# Altium project Power Electronics Final Projects.PrjPcb
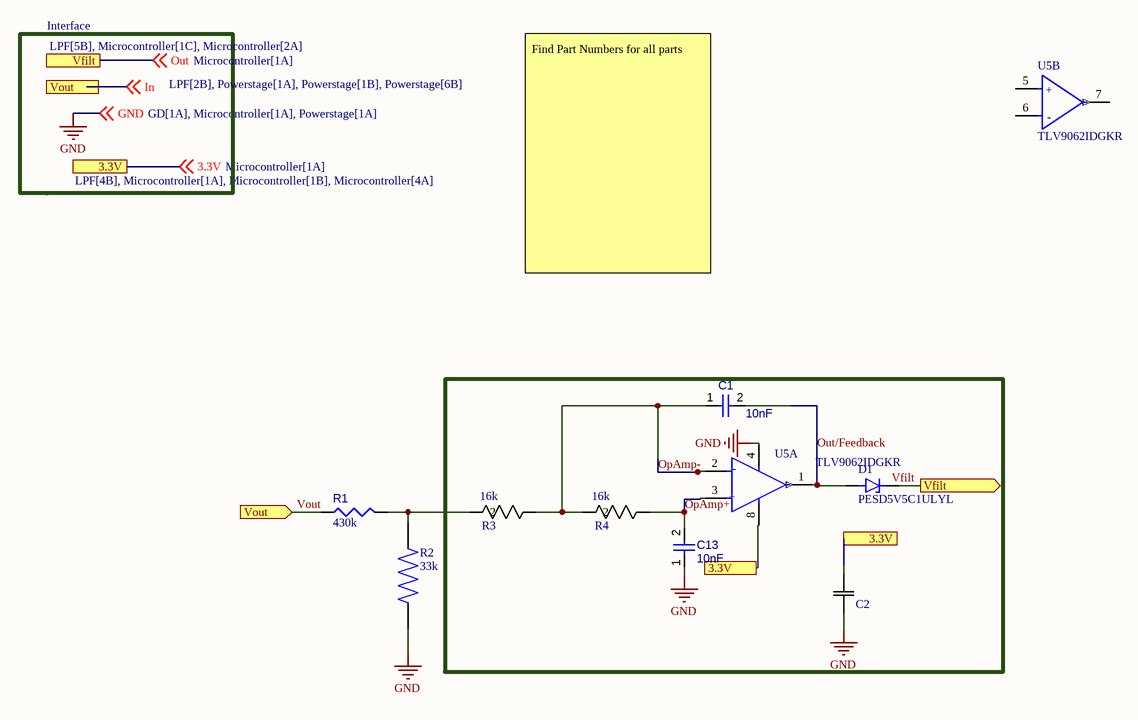
[diagram p0: LPF.SchDoc]
4 sheets, 46 parts. Net scope: flat (ports and power ports of the same name join across sheets).
Board file: Buck Converter.PcbDoc
Sheets:
  LPF.SchDoc
  Microcontroller.SchDoc
  Powerstage.SchDoc
  GD.SchDoc

## Sheet LPF.SchDoc
size A3; SheetNumber: 1; SheetTotal: 4

### Parts
(Parts that share a designator on the sheet are numbered #1, #2 ... from top to bottom, then left to right.)
C1  10nF  [WCAP-CSMH_0805_L2W1.25H1.25]
C2  TMCP1D105MTRF  [CAP_TMCHPTMCP_VIS]  (value not drawn)
C13  10nF  [WCAP-CSMH_0805_L2W1.25H1.25]
D1#1  PESD5V5C1ULYL  [DIO_PESD5V5C1ULYL]
R1  value 430k  [RESC2013X60X40LL20T25]  (hidden comment: ERA-6AEB434V)
R2  value 33k  [RESC2012X65N]  (hidden comment: RNCF0805DTE33K0)
R3  16k  [RC0805N_YAG]
R4  16k  [RC0805N_YAG]
U5  TLV9062IDGKR  [FP-DGK0008A-IPC_A]  (parts A,B of 2)

### Ports
3.3V (see LPF[1A], LPF[4B], Microcontroller[1A], Microcontroller[1B], Microcontroller[4A]), 3.3V (see LPF[4B], Microcontroller[1A], Microcontroller[1B], Microcontroller[4A]), Vfilt (out, see LPF[1A], Microcontroller[1C], Microcontroller[2A]), Vfilt (see LPF[5B], Microcontroller[1C], Microcontroller[2A]), Vout (in, see LPF[1A], Powerstage[1A], Powerstage[1B], Powerstage[6B]), Vout (in, see LPF[2B], Powerstage[1A], Powerstage[1B], Powerstage[6B])

### Nets
GND: C2.1 C13.1 R2.1 U5.4(V-) ; off-sheet GND
3.3V: C2.2 U5.8(V+) ; off-sheet 3.3V, port 3.3V
OpAmp+: C13.2 R4.1 U5.3(IN1+)
OpAmp-: C1.1 R3.1 R4.2 U5.2(IN1-)
Out: D1#1.K ; off-sheet Out, port Vfilt  [project net Vfilt]
Out/Feedback: C1.2 D1#1.A U5.1(OUT1)
Vout: R1.1 ; off-sheet In, port Vout  [also labelled In]
NetR1_2: R1.2 R2.2 R3.2

Not connected (* = marked no-connect by the designer): U5 5(IN2+) 6(IN2-) 7(OUT2)

### Notes on the sheet
- Interface
- Find Part Numbers for all parts
- Labels drawn without touching a wire or pin: Vfilt
- (in symbol CMP-014-00008-1, part A) -; +
- (in symbol CMP-014-00008-1, part B) +; -

### Library data of the parts
C1 C13 = CMP-001-00106-1: Ceramic Capacitor, Multilayer, Ceramic, 500V, 10% +Tol, 10% -Tol, X7R, 15% TC, 0.01uF, Surface Mount, 0805. 885342207014
C2 = CMP-001-00110-1: No Description Available; Mfr_Name: Vishay; Design Item ID: TMCP1D105MTRF; Source: TMCP1D105MTRF.SchLib
D1#1 = CMP-004-00045-1: Esd Protection Device, 5.5V, Dfn1006 Rohs Compliant: Yes; MF: Nexperia USA Inc.; MP: PESD5V5C1ULYL; SnapEDA_Link: https://www.snapeda.com/parts/PESD5V5C1ULYL/Nexperia/view-part/?ref=snap; Check_prices: https://www.snapeda.com/parts/PESD5V5C1ULYL/Nexperia/view-part/?ref=eda; Value: *; Component Type: Standard; Design Item ID: PESD5V5C1ULYL; Pins: 2; Case/Package: SOD-882 Nexperia USA; Source: PESD5V5C1ULYL.SchLib
R1 = CMP-009-00255-1: Fixed Resistor, Thin Film, 0.125W, 430000ohm, 100V, 0.1% +/-Tol, 25ppm/Cel, Surface Mount, 0805; Power: 125mW; Max Operating Temperature: 155°C; Case/Package: 0805; Tolerance: 0.1%; JESD-609 Code: e3; RoHS Compliant: Yes; Min Operating Temperature: -55°C; Mounting Technology: Surface Mount; Construction: Rectangular; Pins: 2
R2 = CMP-009-00254-1: Pins: 2; Price: None; MP: RNCF0805DTE33K0; Availability: Unavailable; Case/Package: None; Component Type: Standard; Design Item ID: RNCF0805DTE33K0; Source: RNCF0805DTE33K0.SchLib
R3 R4 = CMP-009-00253-1: RC0805FR-0716KL; Mfr_Name: Yageo; Source: RC0805FR-0716KL.SchLib; Design Item ID: RC0805FR-0716KL
U5 = CMP-014-00008-1: Operational Amplifier, 2 Func, 1600uV Offset-Max, CMOS, PDSO8; Supply Voltage Limit-Max: 6V; Common-mode Reject Ratio-Nom: 103dB; Unity Gain BW-Nom: 10MHz; Nominal Supply Voltage: 5V; Channels: 2; Slew Rate: 6.5V/µs; Input Offset Voltage-Max: 2mV; Package Body Material: Plastic; Package Style: SMALL OUTLINE, THIN PROFILE, SHRINK PITCHMeter; Terminal Pitch: 0.65mm; RoHS Compliant: Yes; Width: 3mm; Pins: 8; Length: 3mm; Case/Package: TSSOP; Temperature Grade: AUTOMOTIVE; Terminal Position: DUAL; Surface Mount: Yes; Terminal Form: Gull Wing; Max Operating Temperature: 125°C; Moisture Sensitivity Level: 2; JESD-30 Code: S-PDSO-G8; Min Operating Temperature: -40°C; Height - Seated (Max): 1.1mm; Amplifier Type: OPERATIONAL AMPLIFIER; Technology: CMOS; Package Shape: Square; Reach SVHC Compliant: Yes

## Sheet Microcontroller.SchDoc
size A3; SheetNumber: 2; SheetTotal: 4
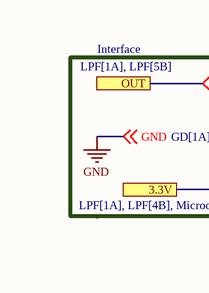
[diagram p1: Microcontroller.SchDoc, left]
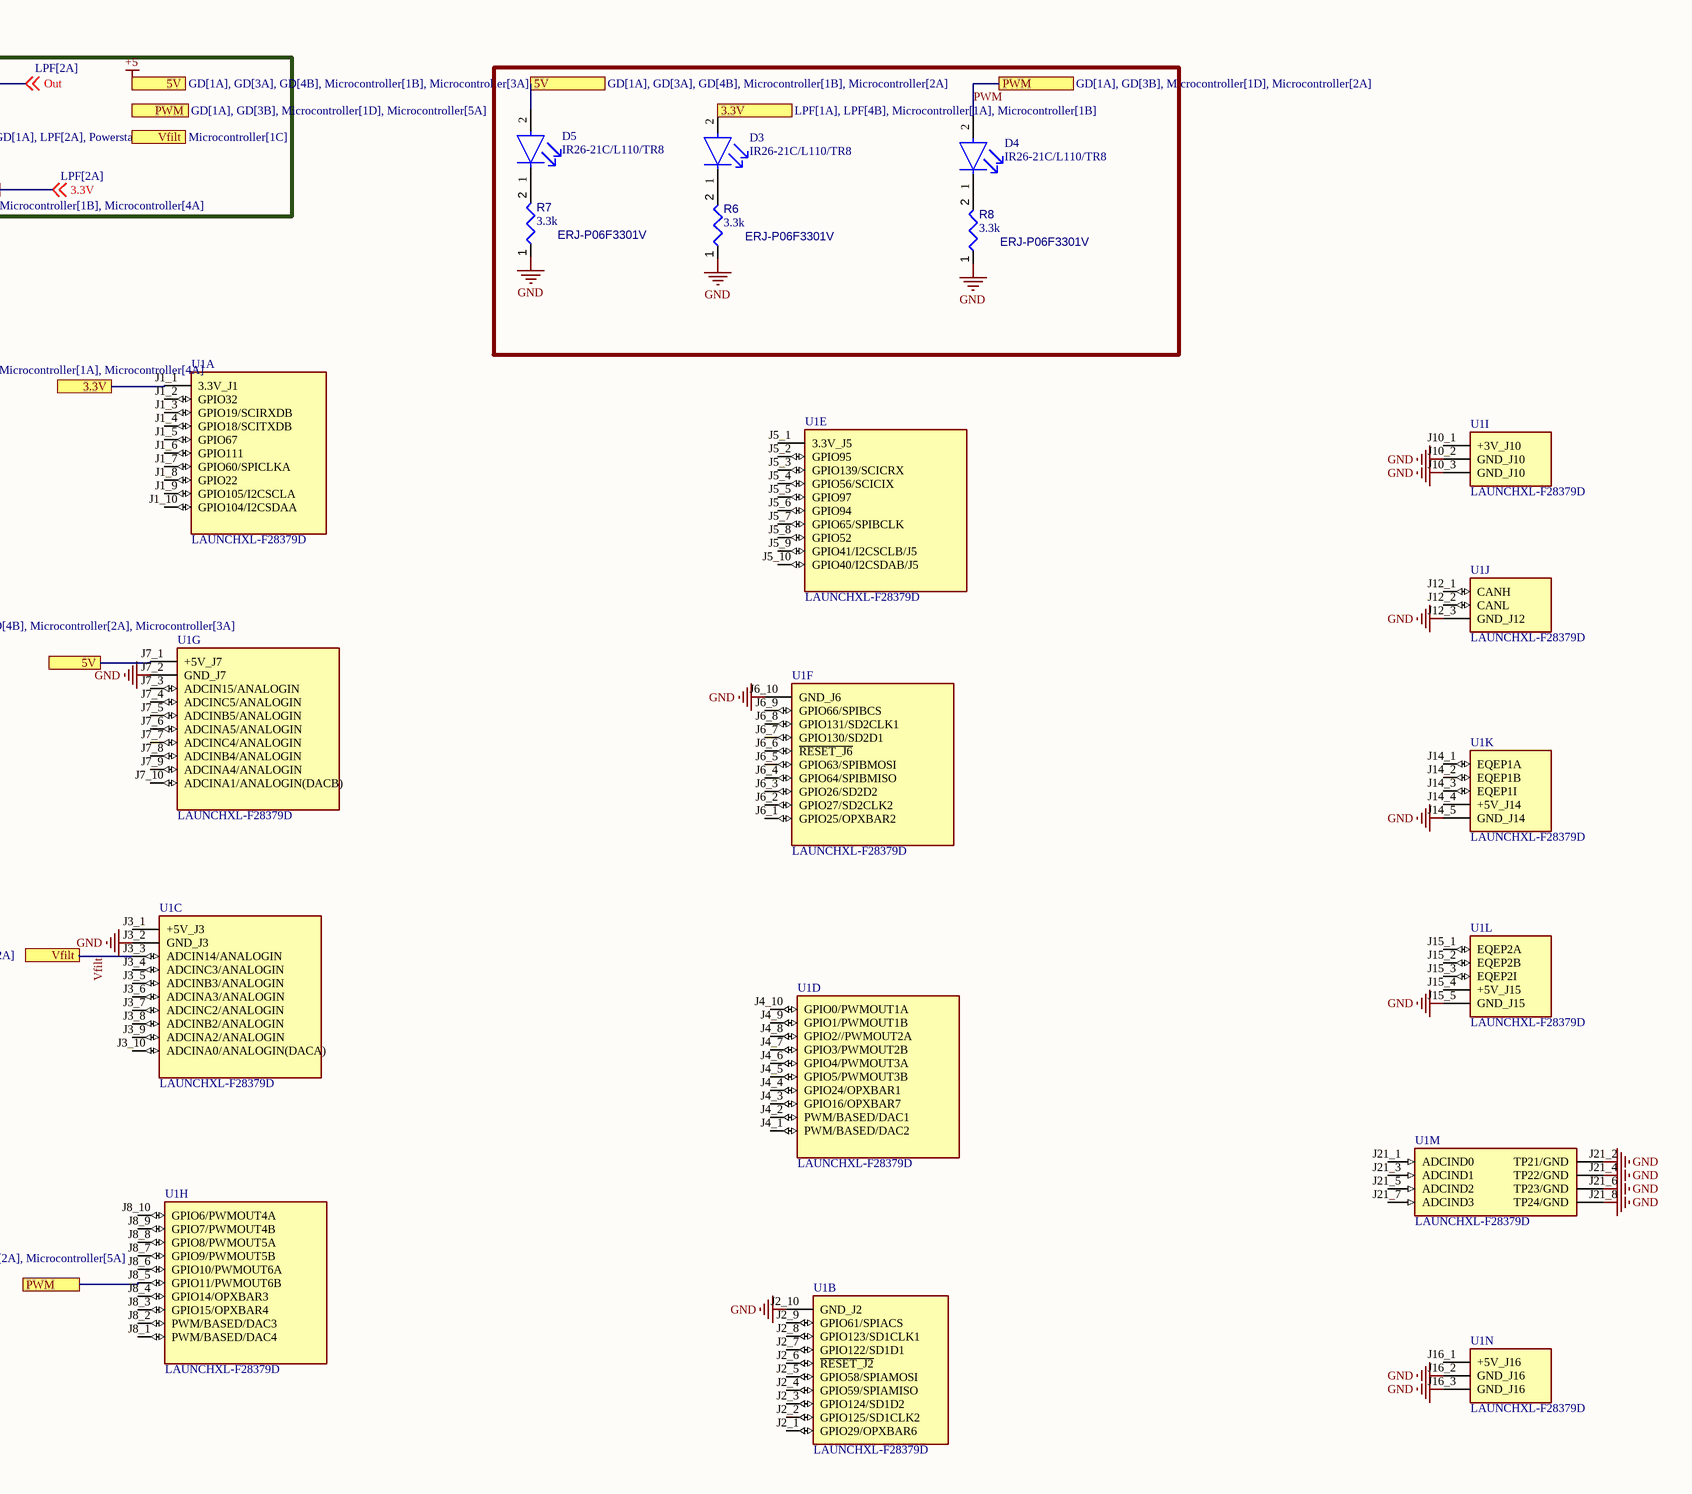
[diagram p2: Microcontroller.SchDoc, right]

### Parts
D3  IR26-21C/L110/TR8  [FP-APTD3216CGCK-MFG]
D4  IR26-21C/L110/TR8  [FP-APTD3216CGCK-MFG]
D5  IR26-21C/L110/TR8  [FP-APTD3216CGCK-MFG]
R6  ERJ-P06F3301V  value 3.3k  [RESC0805(2012)_L]
R7  ERJ-P06F3301V  value 3.3k  [RESC0805(2012)_L]
R8  ERJ-P06F3301V  value 3.3k  [RESC0805(2012)_L]
U1  LAUNCHXL-F28379D  [MOD_LAUNCHXL-F28379D]  (parts A,B,C,D,E,F,G,H,I,J,K,L,M,N of 14)

### Ports
3.3V (see LPF[1A], LPF[4B], Microcontroller[1A], Microcontroller[1B]), 3.3V (see LPF[1A], LPF[4B], Microcontroller[1A], Microcontroller[4A]), 3.3V (see LPF[1A], LPF[4B], Microcontroller[1B], Microcontroller[4A]), 5V (see GD[1A], GD[3A], GD[4B], Microcontroller[1B], Microcontroller[2A]), 5V (see GD[1A], GD[3A], GD[4B], Microcontroller[1B], Microcontroller[3A]), 5V (see GD[1A], GD[3A], GD[4B], Microcontroller[2A], Microcontroller[3A]), OUT (see LPF[1A], LPF[5B]), PWM (see GD[1A], GD[3B], Microcontroller[1D], Microcontroller[2A]), PWM (see GD[1A], GD[3B], Microcontroller[1D], Microcontroller[5A]), PWM (see GD[1A], GD[3B], Microcontroller[2A], Microcontroller[5A]), Vfilt (see Microcontroller[1C]), Vfilt (see Microcontroller[2A])

### Nets
+5: D5.2(A) U1.J7_1(+5V_J7) ; port 5V
GND: R6.1 R7.1 R8.1 U1.J2_10(GND_J2) U1.J3_2(GND_J3) U1.J6_10(GND_J6) U1.J7_2(GND_J7) U1.J10_2(GND_J10) U1.J10_3(GND_J10) U1.J12_3(GND_J12) U1.J14_5(GND_J14) U1.J15_5(GND_J15) U1.J16_2(GND_J16) U1.J16_3(GND_J16) U1.J21_2(TP21/GND) U1.J21_4(TP22/GND) U1.J21_6(TP23/GND) U1.J21_8(TP24/GND) ; off-sheet GND
3.3V: D3.2(A) U1.J1_1(3.3V_J1) ; off-sheet 3.3V, port 3.3V
PWM: D4.2(A) U1.J8_5(GPIO11/PWMOUT6B) ; port PWM
Vfilt: U1.J3_3(ADCIN14/ANALOGIN) ; off-sheet Out, port OUT, port Vfilt  [also labelled Out]
NetD3_1: D3.1(C) R6.2
NetD4_1: D4.1(C) R8.2
NetD5_1: D5.1(C) R7.2

Not connected (* = marked no-connect by the designer): U1 J1_2(GPIO32) J1_3(GPIO19/SCIRXDB) J1_4(GPIO18/SCITXDB) J1_5(GPIO67) J1_6(GPIO111) J1_7(GPIO60/SPICLKA) J1_8(GPIO22) J1_9(GPIO105/I2CSCLA) J1_10(GPIO104/I2CSDAA) J2_1(GPIO29/OPXBAR6) J2_2(GPIO125/SD1CLK2) J2_3(GPIO124/SD1D2) J2_4(GPIO59/SPIAMISO) J2_5(GPIO58/SPIAMOSI) J2_6(~{RESET_J2}) J2_7(GPIO122/SD1D1) J2_8(GPIO123/SD1CLK1) J2_9(GPIO61/SPIACS) J3_1(+5V_J3) J3_4(ADCINC3/ANALOGIN) J3_5(ADCINB3/ANALOGIN) J3_6(ADCINA3/ANALOGIN) J3_7(ADCINC2/ANALOGIN) J3_8(ADCINB2/ANALOGIN) J3_9(ADCINA2/ANALOGIN) J3_10(ADCINA0/ANALOGIN(DACA)) J4_1(PWM/BASED/DAC2) J4_2(PWM/BASED/DAC1) J4_3(GPIO16/OPXBAR7) J4_4(GPIO24/OPXBAR1) J4_5(GPIO5/PWMOUT3B) J4_6(GPIO4/PWMOUT3A) J4_7(GPIO3/PWMOUT2B) J4_8(GPIO2//PWMOUT2A) J4_9(GPIO1/PWMOUT1B) J4_10(GPIO0/PWMOUT1A) J5_1(3.3V_J5) J5_2(GPIO95) J5_3(GPIO139/SCICRX) J5_4(GPIO56/SCICIX) J5_5(GPIO97) J5_6(GPIO94) J5_7(GPIO65/SPIBCLK) J5_8(GPIO52) J5_9(GPIO41/I2CSCLB/J5) J5_10(GPIO40/I2CSDAB/J5) J6_1(GPIO25/OPXBAR2) J6_2(GPIO27/SD2CLK2) J6_3(GPIO26/SD2D2) J6_4(GPIO64/SPIBMISO) J6_5(GPIO63/SPIBMOSI) J6_6(~{RESET_J6}) J6_7(GPIO130/SD2D1) J6_8(GPIO131/SD2CLK1) J6_9(GPIO66/SPIBCS) J7_3(ADCIN15/ANALOGIN) J7_4(ADCINC5/ANALOGIN) J7_5(ADCINB5/ANALOGIN) J7_6(ADCINA5/ANALOGIN) J7_7(ADCINC4/ANALOGIN) J7_8(ADCINB4/ANALOGIN) J7_9(ADCINA4/ANALOGIN) J7_10(ADCINA1/ANALOGIN(DACB)) J8_1(PWM/BASED/DAC4) J8_2(PWM/BASED/DAC3) J8_3(GPIO15/OPXBAR4) J8_4(GPIO14/OPXBAR3) J8_6(GPIO10/PWMOUT6A) J8_7(GPIO9/PWMOUT5B) J8_8(GPIO8/PWMOUT5A) J8_9(GPIO7/PWMOUT4B) J8_10(GPIO6/PWMOUT4A) J10_1(+3V_J10) J12_1(CANH) J12_2(CANL) J14_1(EQEP1A) J14_2(EQEP1B) J14_3(EQEP1I) J14_4(+5V_J14) J15_1(EQEP2A) J15_2(EQEP2B) J15_3(EQEP2I) J15_4(+5V_J15) J16_1(+5V_J16) J21_1(ADCIND0) J21_3(ADCIND1) J21_5(ADCIND2) J21_7(ADCIND3)

### Notes on the sheet
- Interface

### Library data of the parts
D3-D5 = CMP-2000-05792-2: LED GREEN CLEAR 2SMD; Forward Voltage: 2.1V; Forward Current: 20mA; Luminous Intensity: 300mcd; Number of LEDs: 1; Dominant Wavelength: 570nm; Viewing Angle: 50°; Lead Free: Lead Free; Lens Color: Clear; Mount: Surface Mount; Package Quantity: 2000; Height: 1.8mm; Number of Pins: 2; Test Current: 20mA; Case Code (Metric): 3216; Case/Package: 1206; Case Code (Imperial): 1206; Illumination Color: Green; Color: Green; Width: 1.6mm; Packaging: Tape and Reel; Min Operating Temperature: -40°C; Lens Style: Clear; Max Operating Temperature: 85°C; Length: 3.2mm
R6-R8 = CMP-009-00076-5: 1K 0.125W 5% 0805 (2012 Metric)  SMD; Power: 125mW; Tolerance: 5%; Case/Package: 0805; Mounting Technology: SMT; Pins: 2
U1 = CMP-267-000000-2: C2000 Delfino MCU F28379D LaunchPadâ„¢ development kit WITH 3D BODY; MF: Texas Instruments; Pin Count: 107; MP: LAUNCHXL-F28379D; Design Item ID: LAUNCHXL-F28379D; Component Type: Standard; Availability: In Stock; SnapEDA_Link: https://www.snapeda.com/parts/LAUNCHXL-F28379D/Texas+Instruments/view-part/?ref=snap; Check_prices: https://www.snapeda.com/parts/LAUNCHXL-F28379D/Texas+Instruments/view-part/?ref=eda; Package: None; Value: *; Price: None; Purchase-URL: https://pricing.snapeda.com/search/part/LAUNCHXL-F28379D/?ref=eda; Source: LAUNCHXL-F28379D.SchLib

## Sheet Powerstage.SchDoc
size A3; SheetNumber: 3; SheetTotal: 4
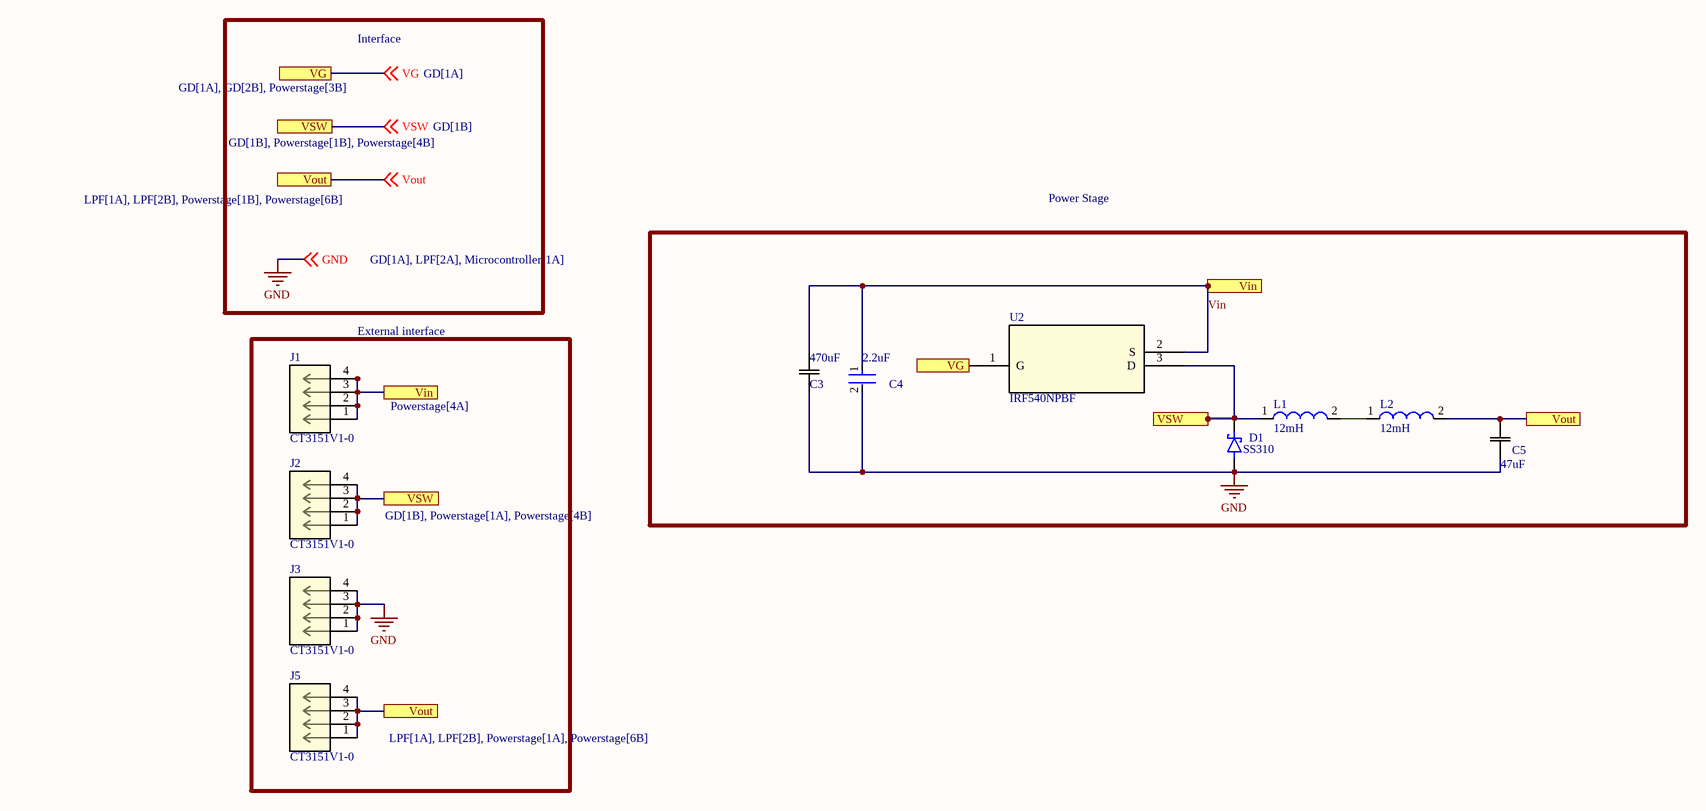
[diagram p3: Powerstage.SchDoc]

### Parts
(Parts that share a designator on the sheet are numbered #1, #2 ... from top to bottom, then left to right.)
C3  470uF  [U1-GG_NCH]
C4  2.2uF  [FP-GRM21B-0_2-e0_2_0_7-IPC_A]
C5  47uF  [CAP_YX_16X31P5_RUB]
D1#2  SS310  [DIO_SS310]
J1  CT3151V1-0  [CON4_CT3151V1-0_CTE]
J2  CT3151V1-0  [CON4_CT3151V1-0_CTE]
J3  CT3151V1-0  [CON4_CT3151V1-0_CTE]
J5  CT3151V1-0  [CON4_CT3151V1-0_CTE]
L1  value 12mH  [INDRD2921W163D3810H2616P]  (hidden comment: 1140-123K-RC)
L2  value 12mH  [INDRD2921W163D3810H2616P]  (hidden comment: 1140-123K-RC)
U2  IRF540NPBF  [PG-TO220-3_INF]

### Blocks framed on the sheet
External interface: J1-J3 J5

### Ports
VG (see GD[1A], GD[2B], Powerstage[1A]), VG (see GD[1A], GD[2B], Powerstage[3B]), Vin (see Powerstage[1B]), Vin (see Powerstage[4A]), Vout (see LPF[1A], LPF[2B], Powerstage[1A], Powerstage[1B]), Vout (see LPF[1A], LPF[2B], Powerstage[1A], Powerstage[6B]), Vout (see LPF[1A], LPF[2B], Powerstage[1B], Powerstage[6B]), VSW (see GD[1B], Powerstage[1A], Powerstage[1B]), VSW (see GD[1B], Powerstage[1A], Powerstage[4B]), VSW (see GD[1B], Powerstage[1B], Powerstage[4B])

### Nets
GND: C3.1 C4.2 C5.1 D1#2.A J3.1 J3.2 J3.3 J3.4 ; off-sheet GND
VG: U2.1(G) ; off-sheet VG, port VG
Vin: C3.2 C4.1 J1.1 J1.2 J1.3 J1.4 U2.2(S) ; port Vin
Vout: C5.2 J5.1 J5.2 J5.3 J5.4 L2.2 ; off-sheet Vout, port Vout
VSW: D1#2.C(K) J2.1 J2.2 J2.3 J2.4 L1.1 U2.3(D) ; off-sheet VSW, port VSW
NetL1_2: L1.2 L2.1

### Notes on the sheet
- Interface
- Power Stage

### Library data of the parts
C3 = CMP-001-00112-1: UVZ2A471MHD; Mfr_Name: Nichicon; Design Item ID: UVZ2A471MHD; Source: UVZ2A471MHD.SchLib
C4 = CMP-06035-000063-2: Chip Multilayer Ceramic Capacitors for General Purpose, 0805, 2.2uF, X7S, 22%, 10%, 100V, GRM21BD72A225KE01L; Capacitance: 1uF; Tolerance: 10%; Length: 2mm; Voltage Rating (DC): 100V; Thickness: 1.25mm; Dielectric: X7S; Width: 1.25mm
C5 = CMP-001-00103-1: ESL476M100AH9AA; Mfr_Name: Rubycon; Design Item ID: 100ZLH470MEFC16X31.5; Source: 100ZLH470MEFC16X31P5.SchLib
D1#2 = CMP-004-00044-1: 3A, 100V, Schottky Rectifier; MF: Taiwan Semiconductor; Value: *; Pins: 2; Design Item ID: SS310; Source: SS310.SchLib; Component Type: Standard; SnapEDA_Link: https://www.snapeda.com/parts/SS310/Taiwan+Semiconductor/view-part/?ref=snap; Check_prices: https://www.snapeda.com/parts/SS310/Taiwan+Semiconductor/view-part/?ref=eda; Case/Package: DO-214AB-2 Taiwan Semiconductor; MP: SS310
J1-J3 J5 = CMP-261-000000-2: No Description Available; Mfr_Name: CAL TEST ELECTRONICS; RefDes: RefDes; Design Item ID: CT3151V1-0; Type: Type; Source: CT3151V1-0.SchLib
L1 L2 = CMP-006-00034-2: 12mH Unshielded Wirewound Inductor 900mA 3.04Ohm Max Radial; MF: Bourns; Design Item ID: 1140-123K-RC; SnapEDA_Link: https://www.snapeda.com/parts/1140-123K-RC/Bourns%20-%20J.W.%20Miller/view-part/259636/?ref=snap; Source: SnapEDAsch.SchLib; MP: 1140-123K-RC; Case/Package: Radial Bourns; Availability: Unavailable; Price: None; Component Type: Standard; Pins: 2
U2 = CMP-306-000000-1: No Description Available; Mfr_Name: Infineon; Type: Type; Design Item ID: IRF540NPBF; Source: IRF540NPBF.SchLib; RefDes: RefDes

## Sheet GD.SchDoc
size A3; SheetNumber: 4; SheetTotal: 4
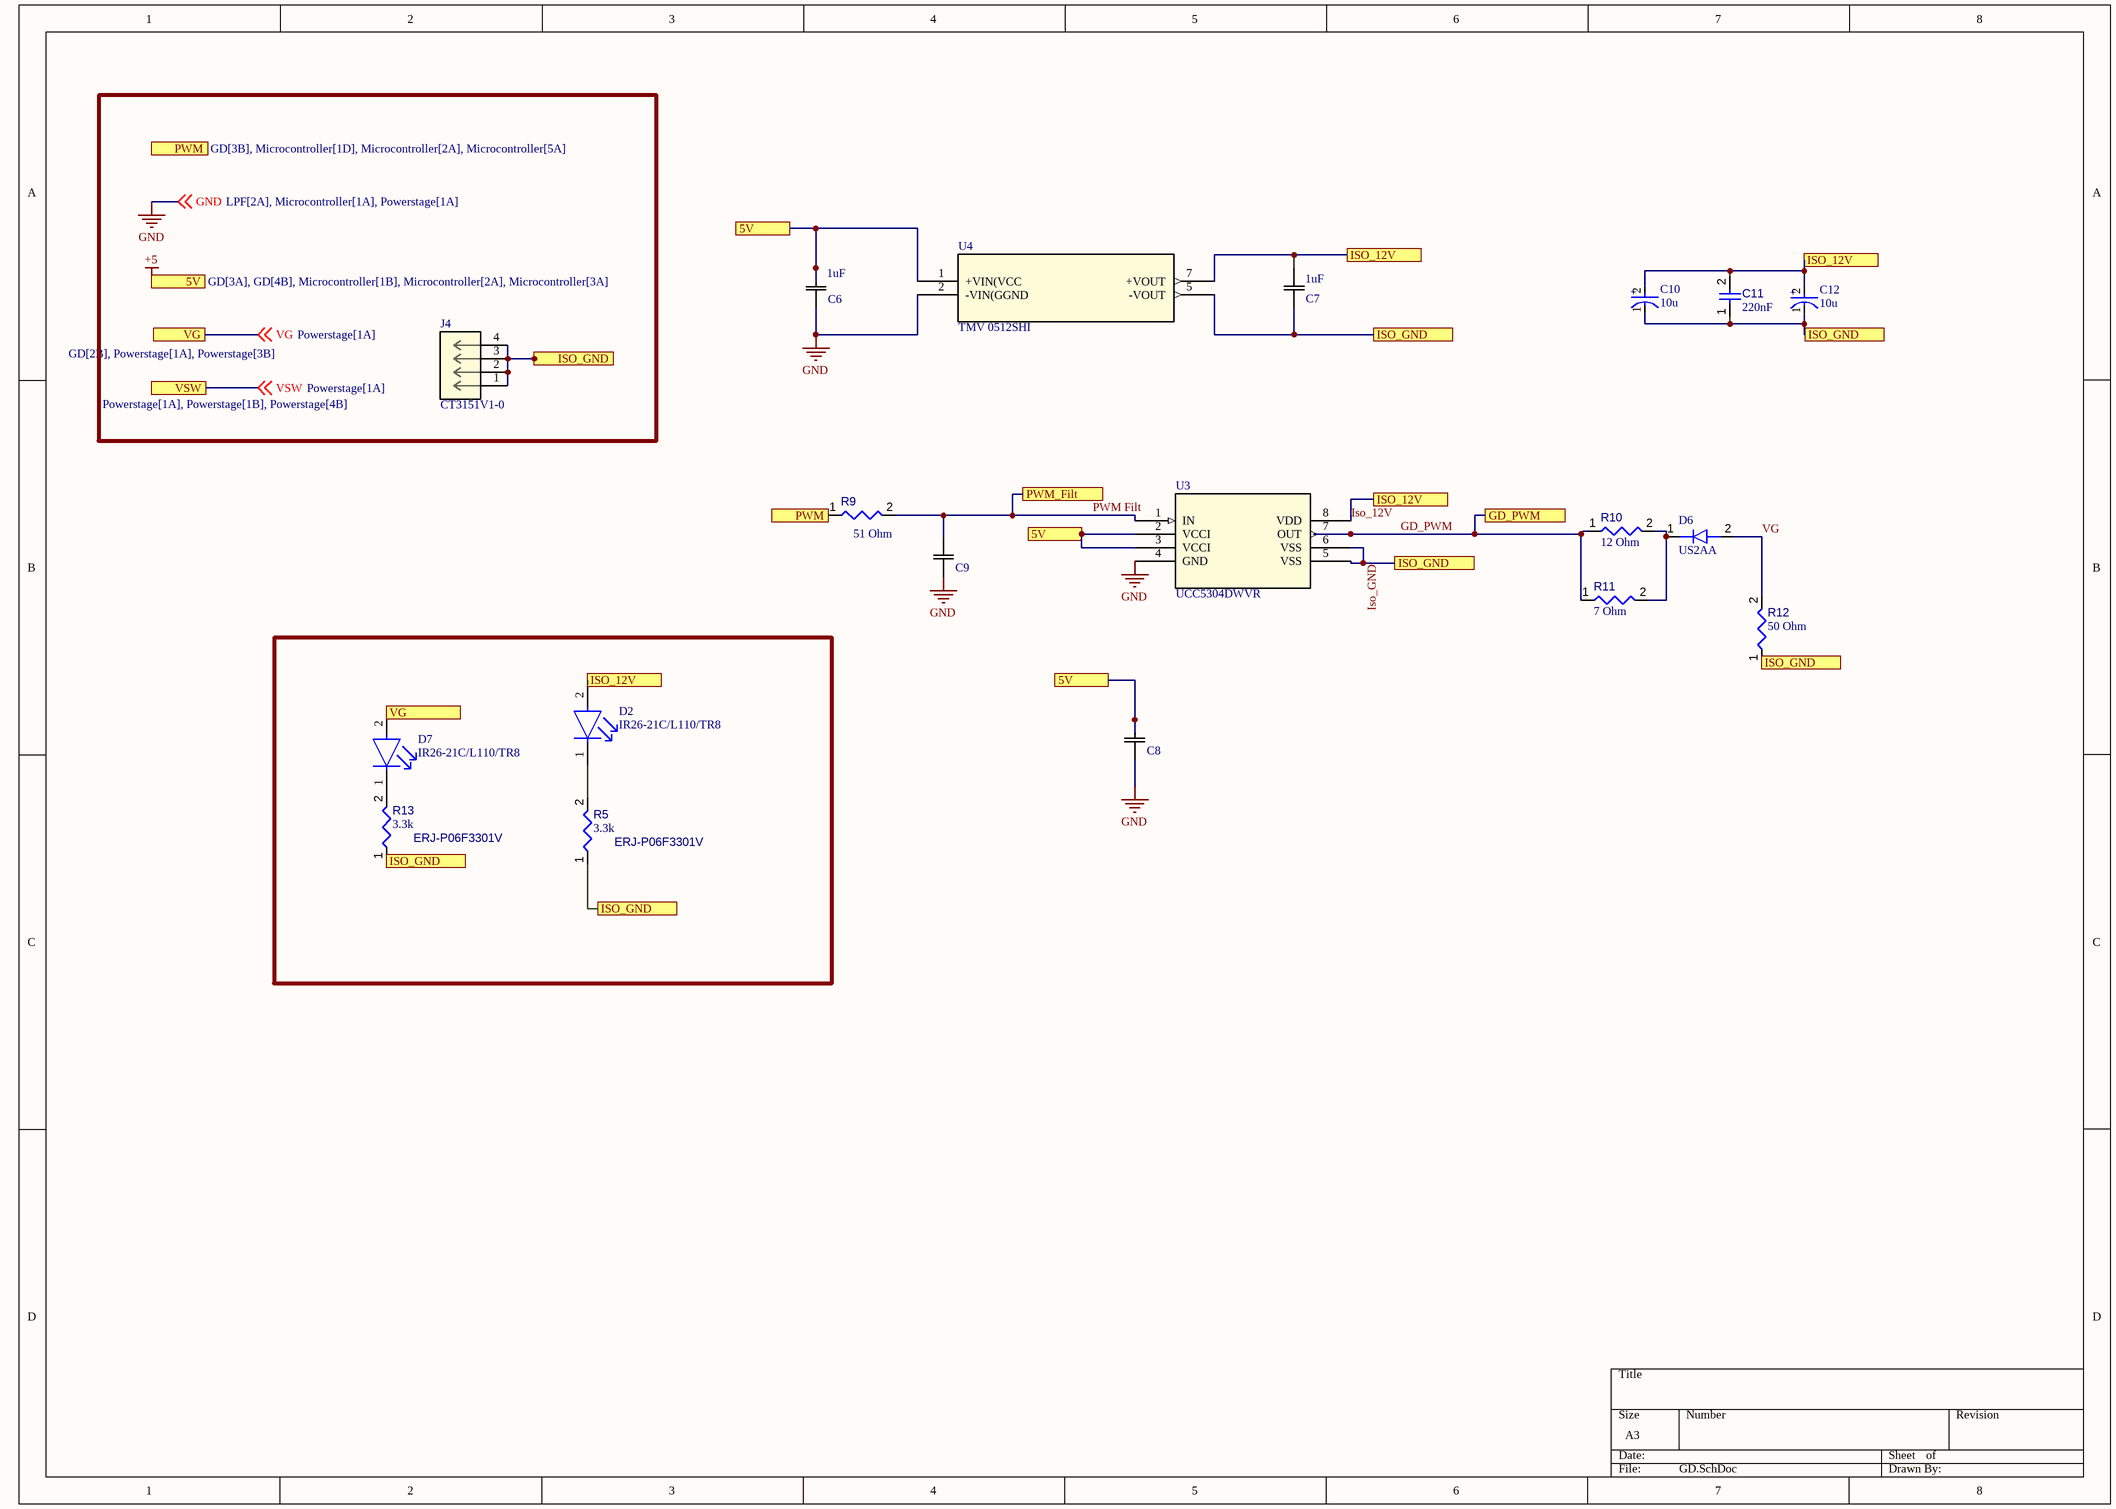
[diagram p4: GD.SchDoc]

### Parts
C6  1uF  [CAP_TMCHPTMCP_VIS]
C7  1uF  [CAP_TMCHPTMCP_VIS]
C8  TMCP1D105MTRF  [CAP_TMCHPTMCP_VIS]  (value not drawn)
C9  C0805C330J1GACAUTO  [CAPC220145_88N_KEM]  (value not drawn)
C10  10u  [FP-TAJA-MFG]
C11  value 220nF  [CAPC2113X120X50ML20T30]  (hidden comment: TAJR224K025RNJ)
C12  10u  [FP-TAJA-MFG]
D2  IR26-21C/L110/TR8  [FP-APTD3216CGCK-MFG]
D6  US2AA  [SMA_ONS]
D7  IR26-21C/L110/TR8  [FP-APTD3216CGCK-MFG]
J4  CT3151V1-0  [CON4_CT3151V1-0_CTE]
R5  ERJ-P06F3301V  value 3.3k  [RESC0805(2012)_L]
R9  value 51 Ohm  [RESC0805(2012)_L]  (hidden comment: ERJ-P06F3301V)
R10  value 12 Ohm  [RESC0805(2012)_L]  (hidden comment: ERJ-P06F3301V)
R11  value 7 Ohm  [RESC0805(2012)_L]  (hidden comment: ERJ-P06F3301V)
R12  value 50 Ohm  [RESC0805(2012)_L]  (hidden comment: ERJ-P06F3301V)
R13  ERJ-P06F3301V  value 3.3k  [RESC0805(2012)_L]
U3  UCC5304DWVR  [SOIC8_DWV_TEX]
U4  TMV 0512SHI  [TMV-HI_SINGLE_TRP]

### Ports
5V (see GD[1A], GD[3A], GD[4B], Microcontroller[1B], Microcontroller[2A], Microcontroller[3A]), 5V (see GD[1A], GD[4B], Microcontroller[1B], Microcontroller[2A], Microcontroller[3A]), 5V (see GD[3A], GD[4B], Microcontroller[1B], Microcontroller[2A], Microcontroller[3A]), GD_PWM, ISO_12V (see GD[3B], GD[6A], GD[6B]), ISO_12V (see GD[3B], GD[6A], GD[7A]), ISO_12V (see GD[3B], GD[6B], GD[7A]), ISO_12V (see GD[6A], GD[6B], GD[7A]), ISO_GND (see GD[2A], GD[2C], GD[3C], GD[6A], GD[6B], GD[7A]), ISO_GND (see GD[2A], GD[2C], GD[3C], GD[6A], GD[6B], GD[7B]), ISO_GND (see GD[2A], GD[2C], GD[3C], GD[6A], GD[7A], GD[7B]), ISO_GND (see GD[2A], GD[2C], GD[3C], GD[6B], GD[7A], GD[7B]), ISO_GND (see GD[2A], GD[2C], GD[6A], GD[6B], GD[7A], GD[7B]), ISO_GND (see GD[2A], GD[3C], GD[6A], GD[6B], GD[7A], GD[7B]), ISO_GND (see GD[2C], GD[3C], GD[6A], GD[6B], GD[7A], GD[7B]), PWM (see GD[1A], Microcontroller[1D], Microcontroller[2A], Microcontroller[5A]), PWM (see GD[3B], Microcontroller[1D], Microcontroller[2A], Microcontroller[5A]), PWM_Filt, VG (see GD[1A], Powerstage[1A], Powerstage[3B]), VG (see GD[2B], Powerstage[1A], Powerstage[3B]), VSW (see Powerstage[1A], Powerstage[1B], Powerstage[4B])

### Nets
+5: C6.2 C8.2 U3.2(VCCI) U3.3(VCCI) U4.1(+VIN(VCC) ; port 5V
GND: C6.1 C8.1 C9.1 U3.4(GND) U4.2(-VIN(GGND) ; off-sheet GND
GD_PWM: R10.1 R11.1 U3.7(OUT) ; port GD_PWM
Iso_12V: C7.2 C10.2(A) C11.2 C12.2(A) D2.2(A) U3.8(VDD) U4.7(+VOUT) ; port ISO_12V
Iso_GND: C7.1 C10.1(C) C11.1 C12.1(C) J4.1 J4.2 J4.3 J4.4 R5.1 R12.1 R13.1 U3.5(VSS) U3.6(VSS) U4.5(-VOUT) ; port ISO_GND
PWM: R9.1 ; port PWM
PWM Filt: C9.2 R9.2 U3.1(IN) ; port PWM_Filt
VG: D6.2(A) D7.2(A) R12.2 ; off-sheet VG, port VG
VSW: off-sheet VSW, port VSW
NetD2_1: D2.1(C) R5.2
NetD6_1: D6.1(K) R10.2 R11.2
NetD7_1: D7.1(C) R13.2

### Notes on the sheet
- (in symbol CMP-04424-000374-1) +

### Library data of the parts
C6 C7 = CMP-001-00110-1: TMCP1D105MTRF; Mfr_Name: Vishay; Design Item ID: TMCP1D105MTRF; Source: TMCP1D105MTRF.SchLib
C8 = CMP-001-00110-1: as C2 on sheet LPF; Design Item ID: TMCP1D105MTRF; Source: TMCP1D105MTRF.SchLib
C9 = CMP-001-00109-1: No Description Available; Mfr_Name: Kemet; Source: C0805C330J1GACAUTO.SchLib; Design Item ID: C0805C330J1GACAUTO
C10 C12 = CMP-04424-000374-1: 10uF 25V  ±10% 8Ω 1206  SMD Tantalum Capacitor F951C106MPAAQ2; ESR (Equivalent Series Resistance): 8R; Leakage Current: 500nA; Dissipation Factor: 4%; Polarity: Polar; Tolerance: 20%; Capacitance: 1uF; Dielectric: X7R; Termination: SMD/SMT; Series: TAJ; Depth: 1.6mm; Voltage Rating (DC): 25V; RoHS Compliant: Yes; Number of Pins: 2; Mount: Surface Mount; Case/Package: 1206; Features: General Purpose; Length: 3.2mm; Height - Seated (Max): 0.071inch; Dielectric Material: Tantalum; Width: 1.6mm; Case Code (Metric): 3216; Min Operating Temperature: -55°C; Max Operating Temperature: 125°C; Radiation Hardening: No; Construction: Flat; Voltage: 25V; Height: 1.6mm; Package Quantity: 1; REACH SVHC: No SVHC; Packaging: Tape and Reel; Voltage Rating: 25V; Case Code (Imperial): 1206; Lead Free: Lead Free; Weight: 0.000571oz
C11 = CMP-001-00111-1: Tantalum Capacitor, Polarized, Tantalum (dry/solid), 25V, 10% +Tol, 10% -Tol, 0.22uF, Surface Mount, 0805; ESR (Equivalent Series Resistance): 21R; Tan Delta: 0.04; Leakage Current: 500nA; Length: 2.05mm; Packaging: Tape and Reel; Polarity: Polarized; Capacitor Type: Tantalum; Min Operating Temperature: -55°C; Width: 1.3mm; Mounting Technology: Surface Mount; Dielectric Material: Tantalum; Rated DC Voltage (URdc): 25V; Terminal Finish: Nickel; Package Style: SMTMeter; Termination: J BEND; Tolerance  (fill in as +-): 10%; Package Shape: Rectangular; Case/Package: 0805; Reach SVHC Compliant: Yes; Height: 1.2mm; RoHS Compliant: Yes; Tolerance (fill in as +-): 10%; JESD-609 Code: e3; Pins: 2; Max Operating Temperature: 125°C
D2 D7 = CMP-2000-05792-2: as D3 on sheet Microcontroller; Lead Free: Lead Free; Lens Color: Clear; Mount: Surface Mount; Package Quantity: 2000; Height: 1.8mm; Number of Pins: 2; Test Current: 20mA; Case Code (Metric): 3216; Case/Package: 1206; Case Code (Imperial): 1206; Illumination Color: Green; Color: Green; Width: 1.6mm; Packaging: Tape and Reel; Min Operating Temperature: -40°C; Lens Style: Clear; Max Operating Temperature: 85°C; Length: 3.2mm
D6 = CMP-323-000000-2: No Description Available; Mfr_Name: onsemi; Type: Type; Design Item ID: US2AA; Source: US2AA.SchLib; RefDes: RefDes
J4 = CMP-261-000000-2: as J1 on sheet Powerstage; RefDes: RefDes; Design Item ID: CT3151V1-0; Type: Type; Source: CT3151V1-0.SchLib
R5 R9-R13 = CMP-009-00076-5: as R6 on sheet Microcontroller; Tolerance: 5%; Case/Package: 0805; Mounting Technology: SMT; Pins: 2
U3 = CMP-303-000002-1: No Description Available; Mfr_Name: Texas Instruments; Source: UCC5304DWVR.SchLib; RefDes: RefDes; Type: Type; Design Item ID: UCC5304DWVR
U4 = CMP-01539-51129752-1: TMV 0512SHI Iso DC-DC Converter; Vin 4.5 to 5.5Vdc; Vout 12Vdc; I/O isolation 5200Vdc; Efficiency: 77%; Output Current: 84mA; Output Voltage: 12V; Isolation Voltage: 5.2kV; Number of Outputs: 1; Output Power: 1W; Min Operating Temperature: -40°C; RoHS: Compliant; Length: 19.5mm; Mount: Through Hole; Width: 7.5mm; Max Operating Temperature: 85°C; NexarPartId: 51129752; Height: 10.2mm; Depth: 10.2mm

## Nets that join several sheets
+5: Microcontroller (D5.2 U1.J7_1), GD (5 pins)
GND: LPF (C2.1 C13.1 R2.1 U5.4), Microcontroller (18 pins), Powerstage (8 pins), GD (5 pins)
3.3V: LPF (C2.2 U5.8), Microcontroller (D3.2 U1.J1_1)
PWM: Microcontroller (D4.2 U1.J8_5), GD (R9.1)
Vfilt: LPF (D1#1.K), Microcontroller (U1.J3_3)
VG: Powerstage (U2.1), GD (D6.2 D7.2 R12.2)
Vout: LPF (R1.1), Powerstage (6 pins)